# Altium schematic sheet power.SchDoc: myA4
size A4; Date: 2018/03/30; DrawnBy: 亓岳鑫; Organization: Altium Limited; Address1: 3 Minna Close; Address2: Belrose; Address3: NSW 2085; Address4: Australia; DocumentNumber: 2; Revision: Alfa 2.0; SheetNumber: 2; SheetTotal: 6; Time: 17:30
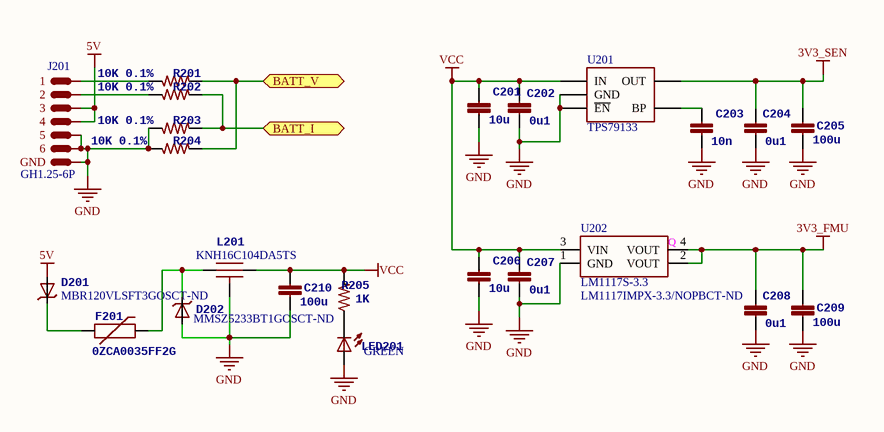
[diagram p0: power.SchDoc]

## Parts
C201  10u  [0805-CAP]
C202  0u1  [0603-CAP]
C203  10n  [0603-CAP]
C204  0u1  [0603-CAP]
C205  100u  [1206-CAP]
C206  10u  [0805-CAP]
C207  0u1  [0603-CAP]
C208  0u1  [0603-CAP]
C209  100u  [1206-CAP]
C210  100u  [1206-CAP]
D201  Supplier Part Number 1: MBR120VLSFT3GOSCT-ND  [SOD-123LF]  (hidden comment: MBR120VLSFT3GOSCT)
D202  Supplier Part Number 1: MMSZ5233BT1GOSCT-ND  [SOD-123LF]  (hidden comment: MMSZ5233BT1G)
F201  0ZCA0035FF2G  [1206-FUSE]
J201  GH1.25-6P  [1.25-6P]
L201  KNH16C104DA5TS  [0603-KNH16-DA]
LED201  Color: GREEN  [0603-LED]  (hidden comment: APG1608CGKC)
R201  10K 0.1%  [0603-RES]
R202  10K 0.1%  [0603-RES]
R203  10K 0.1%  [0603-RES]
R204  10K 0.1%  [0603-RES]
R205  1K  [0603-RES]
U201  TPS79133  [R-PDSO-G5]
U202  LM1117S-3.3  Supplier Part Number 1: LM1117IMPX-3.3/NOPBCT-ND  [SOT223-4N]

## Ports
BATT_I, BATT_V

## Nets
3V3_FMU: C208.P$1 C209.P$1 U202.2(VOUT) U202.4(VOUT)
3V3_SEN: C204.P$1 C205.P$1 U201.5(OUT)
5V: D201.A J201.3 J201.4
GND: C201.P$2 C202.P$2 C203.P$2 C204.P$2 C205.P$2 C206.P$2 C207.P$2 C208.P$2 C209.P$2 C210.P$2 D202.A J201.5 J201.6 J201.GND L201.GND LED201.A R203.1 R204.1 U201.2(GND) U201.3(~{EN}) U202.1(GND)
VCC: C201.P$1 C202.P$1 C206.P$1 C207.P$1 C210.P$1 L201.P$2 R205.2 U201.1(IN) U202.3(VIN)
BATT_I: R202.2 R203.2 ; port BATT_I
BATT_V: R201.2 R204.2 ; port BATT_V
NetC203_P$1: C203.P$1 U201.4(BP)
NetD201_C: D201.C F201.1
NetD202_C: D202.C F201.2 L201.P$1
NetJ201_1: J201.1 R201.1
NetJ201_2: J201.2 R202.1
NetLED201_C: LED201.C R205.1

## Notes on the sheet
- Title:
- Drawn by:
- Date:
- @
- Sheet:
- /
- (in symbol LDO-LM1117S-3.3) Q

## Library data of the parts
C201 C206 = CAP0805-10uF: Capacitor, 10uF, 10V, Y5V, 0805, Ceramic; PARTNO: CC0805ZKY5V6BB106; 3DR_PARTNO: ECM0713; Value: 10u; Supplier 1: Digi-Key; Supplier Part Number 1: 311-1355-1-ND
C202 C204 C207 C208 = CAP0603-0.1uF: Capacitor, 0.1uF, 16V, Y5V, 0402, Ceramic; PARTNO: CC0402ZRY5V7BB104; 3DR_PARTNO: ECM0700; Value: 0u1; Supplier 1: Digi-Key; Supplier Part Number 1: 311-1776-1-ND
C203 = CAP0603-10nF: Capacitor, 10nF, 50V; PARTNO: CC0402ZRY5V7BB104; 3DR_PARTNO: ECM0700; Value: 10n
C205 C209 C210 = CAP1206-100uF: CAP CER 100UF 10V 20% X5R 1206; PARTNO: C3216X5R1A107M160AC; 3DR_PARTNO: ECM0716; Value: 100U; Supplier 1: Digi-Key; Supplier Part Number 1: 445-6007-1-ND
D201 = DIODE-SBD_SOD123FL: DIODE SCHOTTKY 20V 1A , 0.34V, SOD123FL; Value: 20V 1A; Supplier 1: Digi-Key
D202 = DIODE-ZENER: DIODE ZENER 6V 500MW SOD123; Value: 40v; 说明: 数目多的话参考PESD0402-140 等芯片; Supplier 1: Digi-Key
F201 = FUSE-1206: PTC RESTTBLE 0.35A 16V CHIP 1206, 自恢复保险; 3DR_PARTNO: ECM0802; PARTNO: 0ZCA0035FF2G; Supplier 1: Digi-Key; Value: 0.35A; Supplier Part Number 1: 507-1479-1-ND
J201 = GH1.25-6P: GH1.25mm 立贴 间距1.25mm 连接器贴片
L201 = EMI Filters: EMI FILTER CAP 0.1UF 2A 25V 0603; 3DR_PARTNO: ECM0719; Value: 0u1; Supplier 1: Digi-Key; PARTNO: KNH16C104DA5TS
LED201 = LED0603-GREEN: 2.1v, LED GREEN CLEAR 0603 SMD; 3DR_PARTNO: ECM0515; PARTNO: APG1608CGKC; Supplier 1: Digi-Key; Supplier Part Number 1: 754-1357-1-ND
R201-R204 = RES0603-10k_0.1%: RES 10 OHM 1/10W 0.1% 0603; Value: 10K 0.1%; Supplier 1: Digi-Key; Supplier Part Number 1: P10KDBCT-ND
R205 = RES0603-1K: RES 1K OHM 1/10W 5% 0603; Value: 1K; Supplier 1: Digi-Key; Supplier Part Number 1: 311-1.0KGRCT-ND
U201 = LDO-TPS79133: Supplier 1: Digi-Key; Supplier Part Number 1: 296-11866-1-ND
U202 = LDO-LM1117S-3.3: LDO, ouput 3.3V/1A, 0.04% Line Regulation and 0.1% load Regulation.; Supplier 1: Digi-Key